# EAGLE design BusPirate-24Fv1a.final (EAGLE 5.03)
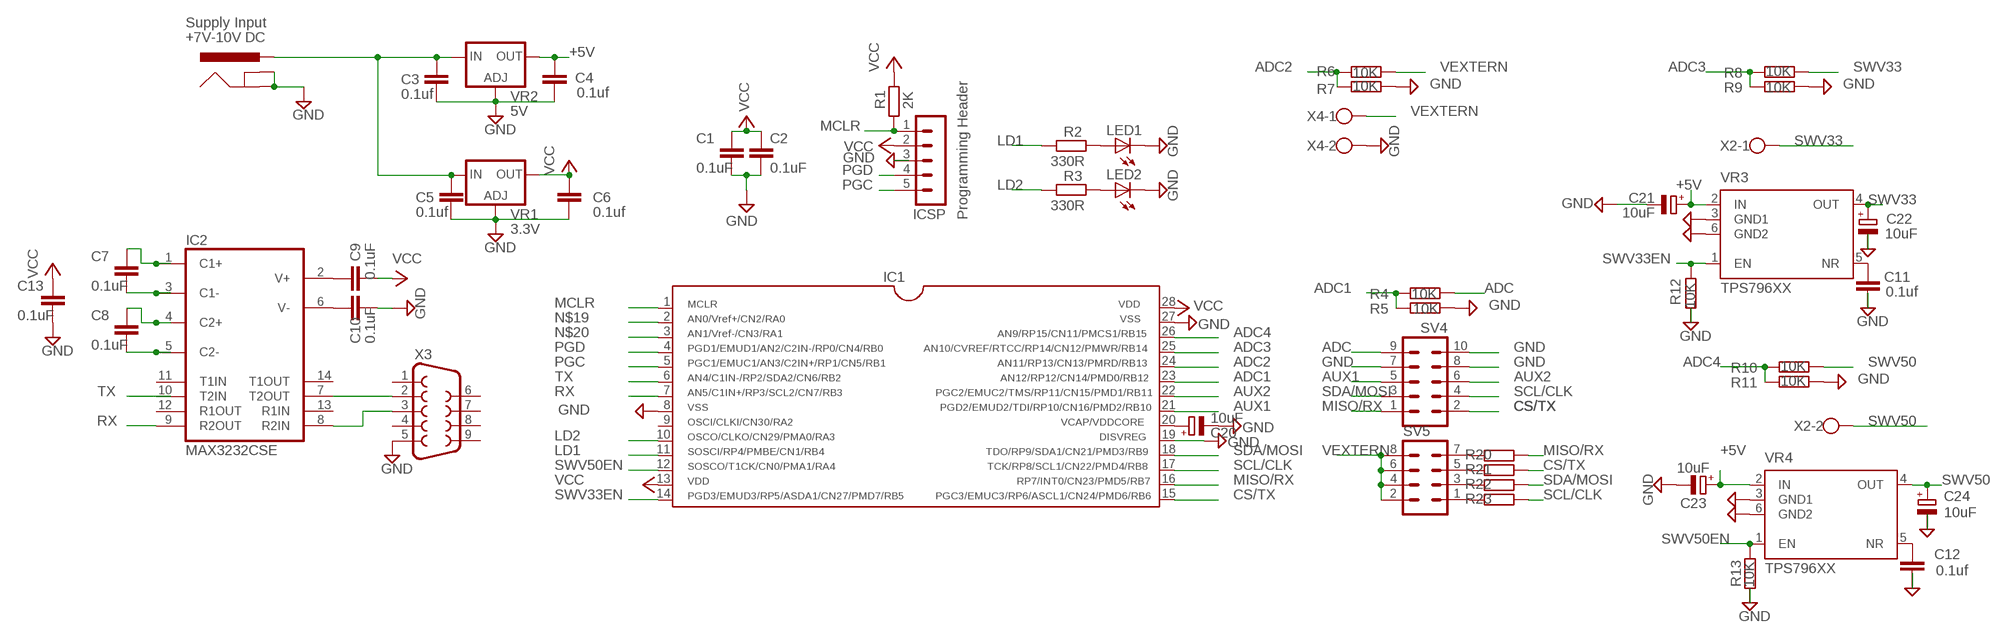
[diagram p0: schematic, sheet 1]

## Parts
C1  0.1uF  C-EUC0805  [C0805]
C2  0.1uF  C-EUC0805  [C0805]
C3  0.1uf  C-EUC0805  [C0805]
C4  0.1uf  C-EUC0805  [C0805]
C5  0.1uf  C-EUC0805  [C0805]
C6  0.1uf  C-EUC0805  [C0805]
C7  0.1uF  C-EUC0805  [C0805]
C8  0.1uF  C-EUC0805  [C0805]
C9  0.1uF  C-EUC0805  [C0805]
C10  0.1uF  C-EUC0805  [C0805]
C11  0.1uf  C-EUC0805  [C0805]
C12  0.1uf  C-EUC0805  [C0805]
C13  0.1uF  C-EUC0805  [C0805]
C20  10uF  CPOL-EUSMCA  [SMC_A]
C21  10uF  CPOL-EUSMCA  [SMC_A]
C22  10uF  CPOL-EUSMCA  [SMC_A]
C23  10uF  CPOL-EUSMCA  [SMC_A]
C24  10uF  CPOL-EUSMCA  [SMC_A]
IC1  PIC24FJ64GA002  [SO28W]
IC2  MAX3232CSE  [SO16]
ICSP  MA05-1  [MA05-1]
J1  POWER_JACKPTH  [POWER_JACK_PTH]
LED1  LEDCHIP-LED0805  [CHIP-LED0805]
LED2  LEDCHIP-LED0805  [CHIP-LED0805]
R1  2K  R-EU_R0805  [R0805]
R2  330R  R-EU_M0805  [M0805]
R3  330R  R-EU_M0805  [M0805]
R4  10K  R-EU_M0805  [M0805]
R5  10K  R-EU_M0805  [M0805]
R6  10K  R-EU_M0805  [M0805]
R7  10K  R-EU_M0805  [M0805]
R8  10K  R-EU_M0805  [M0805]
R9  10K  R-EU_M0805  [M0805]
R10  10K  R-EU_M0805  [M0805]
R11  10K  R-EU_M0805  [M0805]
R12  10K  R-EU_M0805  [M0805]
R13  10K  R-EU_M0805  [M0805]
R20  R-EU_0207/12  [0207/12]
R21  R-EU_0207/12  [0207/12]
R22  R-EU_0207/12  [0207/12]
R23  R-EU_0207/12  [0207/12]
SV4  MA05-2  [MA05-2]
SV5  MA04-2  [MA04-2]
VR1  3.3V  LD117AS12TR  [SOT223]
VR2  5V  LD117AS12TR  [SOT223]
VR3  TPS796XX  [SOT223-6]
VR4  TPS796XX  [SOT223-6]
X2  W237-102  [W237-102]
X3  F09H  [F09H]
X4  W237-102  [W237-102]

## Nets
+5V: C4.1 C21.+ C23.+ VR2.4(OUT) VR3.2(IN) VR4.2(IN)
ADC: R4.1 SV4.9
ADC1: IC1.23 R4.2 R5.2
ADC2: IC1.24 R6.2 R7.2
ADC3: IC1.25 R8.2 R9.2
ADC4: IC1.26 R10.2 R11.2
AUX1: IC1.21 SV4.5
AUX2: IC1.22 SV4.6
CS/TX: IC1.15 R21.1 SV4.2
GND: C1.2 C2.2 C3.2 C4.2 C5.2 C6.2 C10.2 C11.2 C12.2 C13.2 C20.- C21.- C22.- C23.- C24.- IC1.8 IC1.19 IC1.27 ICSP.3 J1.GND J1.GNDBREAK LED1.C LED2.C R5.1 R7.1 R9.1 R11.1 R12.2 R13.2 SV4.7 SV4.8 SV4.10 VR1.1(ADJ) VR2.1(ADJ) VR3.3(GND1) VR3.6(GND2) VR4.3(GND1) VR4.6(GND2) X3.5 X4.2
LD1: IC1.11 R2.2
LD2: IC1.10 R3.2
MCLR: IC1.1 ICSP.1 R1.1
MISO/RX: IC1.16 R20.1 SV4.1
N$1: R23.2 SV5.1
N$2: R20.2 SV5.7
N$3: C20.+ IC1.20
N$4: R21.2 SV5.5
N$5: R22.2 SV5.3
N$6: LED2.A R3.1
N$7: LED1.A R2.1
N$8: C9.2 IC2.2(V+)
N$9: C3.1 C5.1 J1.PWR VR1.3(IN) VR2.3(IN)
N$11: C10.1 IC2.6(V-)
N$13: C11.1 VR3.5(NR)
N$14: C7.2 IC2.3(C1-)
N$15: C7.1 IC2.1(C1+)
N$16: C8.1 IC2.4(C2+)
N$17: C8.2 IC2.5(C2-)
N$18: C12.1 VR4.5(NR)
N$19: IC1.2
N$20: IC1.3
N$29: IC2.7(T2OUT) X3.2
N$30: IC2.8(R2IN) X3.3
PGC: IC1.5 ICSP.5
PGD: IC1.4 ICSP.4
RX: IC1.7 IC2.9(R2OUT)
SCL/CLK: IC1.17 R23.1 SV4.4
SDA/MOSI: IC1.18 R22.1 SV4.3
SWV33: C22.+ R8.1 VR3.4(OUT) X2.1
SWV33EN: IC1.14 R12.1 VR3.1(EN)
SWV50: C24.+ R10.1 VR4.4(OUT) X2.2
SWV50EN: IC1.12 R13.1 VR4.1(EN)
TX: IC1.6 IC2.10(T2IN)
VCC: C1.1 C2.1 C6.1 C9.1 C13.1 IC1.13 IC1.28 ICSP.2 R1.2 VR1.4(OUT)
VEXTERN: R6.1 SV5.2 SV5.4 SV5.6 SV5.8 X4.1
Unconnected: IC1.9 IC2.11(T1IN) IC2.12(R1OUT) IC2.13(R1IN) IC2.14(T1OUT) X3.1 X3.4 X3.6 X3.7 X3.8 X3.9

## Notes on the sheet
- Supply Input
- +7V-10V DC
- Programming Header

## Power pins joined to a net without a drawn wire
GND: IC2.15(GND)
VCC: IC2.16(VCC)

## Library data of the parts
C1-C13 = rcl:C-EU: CAPACITOR, European symbol
C20-C24 = rcl:CPOL-EU: POLARIZED CAPACITOR, European symbol
IC1 = microchip-pic24:PIC24FJ64GA002
IC2 = maxim:MAX3232*: True RS-232 Transceivers 3.0V to 5.5V, Low-Power up to 1Mbps, Using Four 0.1µF External Capacitors Source: http://pdfserv.maxim-ic.com/en/ds/MAX3222-MAX3241.pdf
ICSP = con-lstb:MA05-1: PIN HEADER
J1 = SparkFun:POWER_JACK: Power Jack This is the standard 5.5mm barrel jack for power. The PTH is the most common, proven, reliable, footprint. All others are experimental. The Slot footprint only works if the mill layer is transmitted to the PCB fab house so be warned. Spark Fun Electronics SKU : PRT-00119. Mating wall wart : TOL-00298 (and others)
LED1 LED2 = led:LED: LED OSRAM: - CHIPLED LG R971, LG N971, LY N971, LG Q971, LY Q971, LO R971, LY R971 LH N974, LH R974 LS Q976, LO Q976, LY Q976 LO Q996 - Hyper CHIPLED LW Q18S LB Q993, LB Q99A, LB R99A - SideLED LS A670, LO A670, LY A670, LG A670, LP A670 LB A673, LV A673, LT A673, LW A673 LH A674 LY A675 LS A676, LA A676, LO A676, LY A676, LW A676 LS A679, LY A679, LG A679 - Hyper Micro SIDELED® LS Y876, LA Y876, LO Y876, LY Y876 LT Y87S - SmartLED LW L88C, LW L88S LB L89C, LB L89S, LG L890 LS L89K, LO L89K, LY L89K LS L896, LA L896, LO L896, LY L896 - TOPLED LS T670, LO T670, LY T670, LG T670, LP T670 LSG T670, LSP T670, LSY T670, LOP T670, LYG T670 LG T671, LOG T671, LSG T671 LB T673, LV T673, LT T673, LW T673 LH T674 LS T676, LA T676, LO T676, LY T676, LB T676, LH T676, LSB T676, LW T676 LB T67C, LV T67C, LT T67C, LS T67K, LO T67K, LY T67K, LW E67C LS E67B, LA E67B, LO E67B, LY E67B, LB E67C, LV E67C, LT E67C LW T67C LS T679, LY T679, LG T679 LS T770, LO T770, LY T770, LG T770, LP T770 LB T773, LV T773, LT T773, LW T773 LH T774 LS E675, LA E675, LY E675, LS T675 LS T776, LA T776, LO T776, LY T776, LB T776 LHGB T686 LT T68C, LB T68C - Hyper Mini TOPLED® LB M676 - Mini TOPLED Santana® LG M470 LS M47K, LO M47K, LY M47K Source: http://www.osram.convergy.de LUXEON: - LUMILED® LXK2-PW12-R00, LXK2-PW12-S00, LXK2-PW14-U00, LXK2-PW14-V00 LXK2-PM12-R00, LXK2-PM12-S00, LXK2-PM14-U00 LXK2-PE12-Q00, LXK2-PE12-R00, LXK2-PE12-S00, LXK2-PE14-T00, LXK2-PE14-U00 LXK2-PB12-K00, LXK2-PB12-L00, LXK2-PB12-M00, LXK2-PB14-N00, LXK2-PB14-P00, LXK2-PB14-Q00 LXK2-PR12-L00, LXK2-PR12-M00, LXK2-PR14-Q00, LXK2-PR14-R00 LXK2-PD12-Q00, LXK2-PD12-R00, LXK2-PD12-S00 LXK2-PH12-R00, LXK2-PH12-S00 LXK2-PL12-P00, LXK2-PL12-Q00, LXK2-PL12-R00 Source: www.luxeon.com KINGBRIGHT: KA-3528ASYC Source: www.kingbright.com
R1-R3 R20-R23 = rcl:R-EU_: RESISTOR, European symbol
R4-R13 = resistor:R-EU_: RESISTOR, European symbol
SV4 = con-lstb:MA05-2: PIN HEADER
SV5 = con-lstb:MA04-2: PIN HEADER
VR1 VR2 = v-reg:LD117A?*: Low drop fixed and adjustable positive voltage regulators 1 A Source: http://www.st.com/stonline/products/literature/ds/7194/ld1117axx.pdf
VR3 VR4 = SOT223-6:TPS796XX
X2 X4 = con-wago-500:W237-102: WAGO SCREW CLAMP
X3 = con-subd:F09: SUB-D

## Board
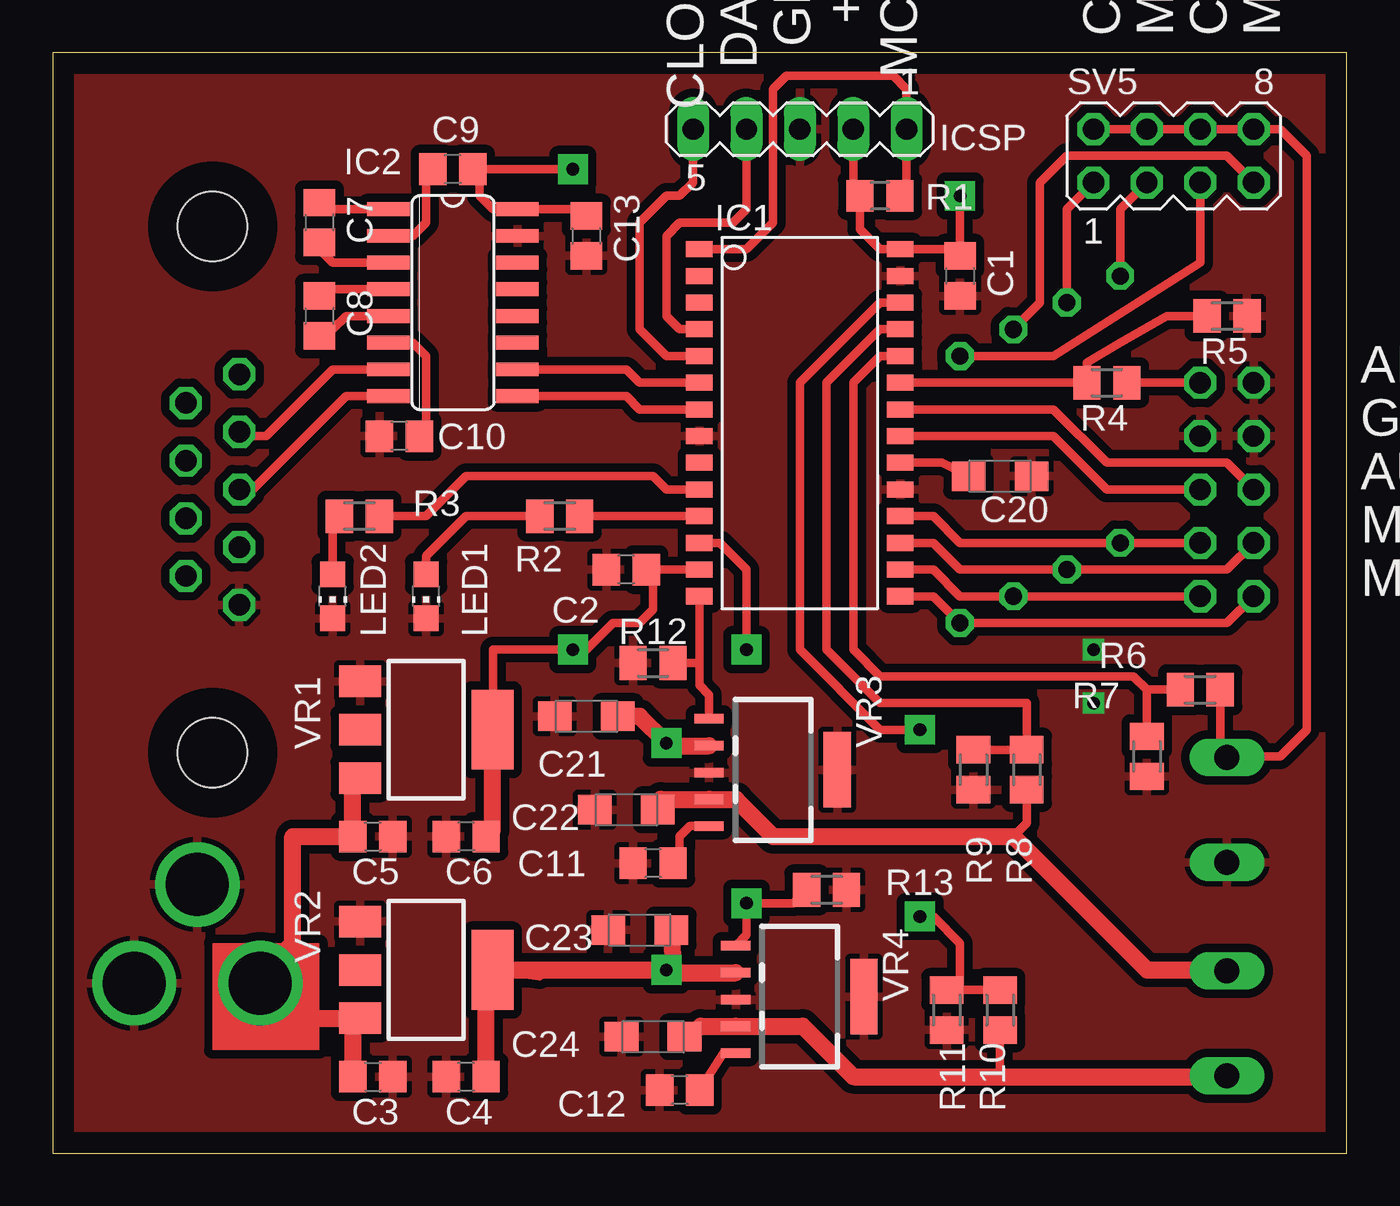
[diagram p1: board, top side]
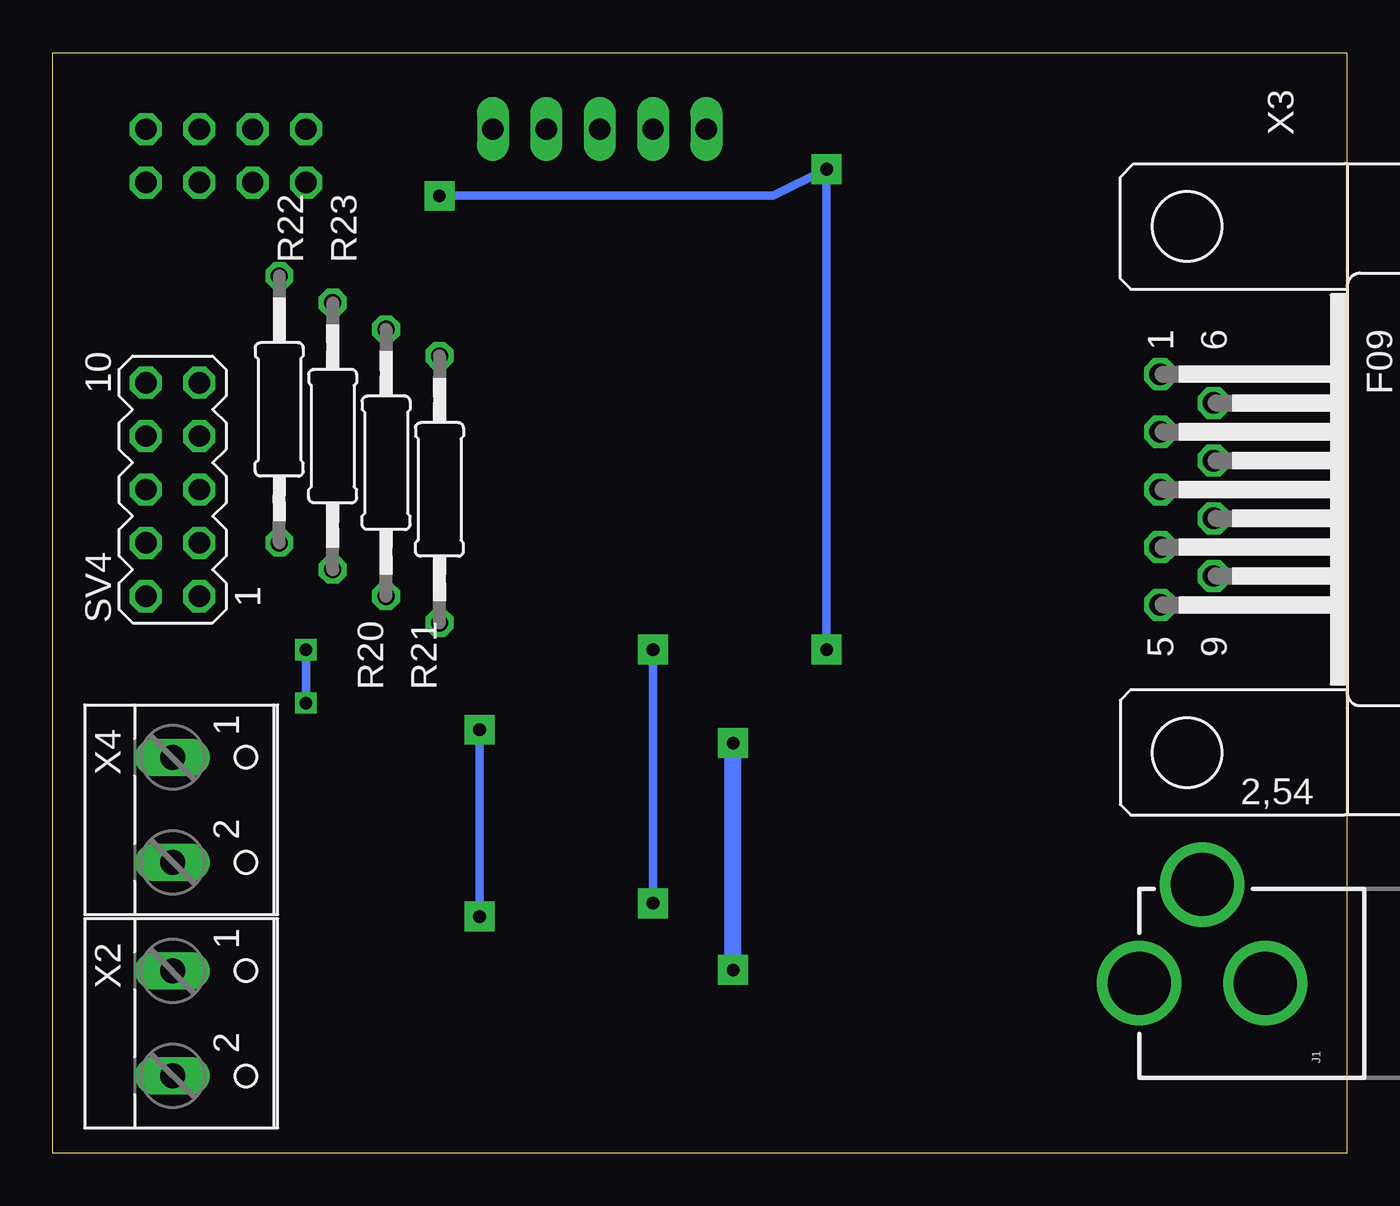
[diagram p2: board, bottom side, seen from below]

Size 61.59 x 52.38 mm. Coordinates in mm from the lower left corner, seen from the top.
Outline: 61.59,0 61.59,52.38 0,52.38 0,0 61.59,0
Copper layers (1*16): Top 0.035mm / dielectric 1.5mm / Bottom 0.035mm
Design rules "10mils": minimum track width 10mil, minimum drill 24mil, track to track 10mil, track to pad 10mil, pad to pad 10mil, via to via 10mil, smd to smd 10mil, copper to edge 40mil, drill to drill 10mil, minimum pad ring 10mil, minimum via ring 8mil, stop-mask expansion 0mil, vias tented up to drill 0mil, thermal gap 10mil

### Footprints (pad centres in the part's own frame; a part is rotated, then mirrored left to right if it is on the bottom)
C0805 = smd 1.3 x 1.5: 1 -0.95,0; 2 0.95,0
SMC_A = smd 1.6 x 1.4: + -1.5,0; - 1.5,0
SO28W = smd 0.762 x 1.27: 1 -8.89,-4.78; 2 -7.62,-4.78; 3 -6.35,-4.78; 4 -5.08,-4.78; 5 -3.81,-4.78; 6 -2.54,-4.78; 7 -1.27,-4.78; 8 0,-4.78; 9 1.27,-4.78; 10 2.54,-4.78; 11 3.81,-4.78; 12 5.08,-4.78; 13 6.35,-4.78; 14 7.62,-4.78; 15 7.62,4.78; 16 6.35,4.78; 17 5.08,4.78; 18 3.81,4.78; 19 2.54,4.78; 20 1.27,4.78; 21 0,4.78; 22 -1.27,4.78; 23 -2.54,4.78; 24 -3.81,4.78; 25 -5.08,4.78; 26 -6.35,4.78; 27 -7.62,4.78; 28 -8.89,4.78
SO16 = smd 0.66 x 2.032: 1 -4.445,-3.073; 2 -3.175,-3.073; 3 -1.905,-3.073; 4 -0.635,-3.073; 5 0.635,-3.073; 6 1.905,-3.073; 7 3.175,-3.073; 8 4.445,-3.073; 9 4.445,3.073; 10 3.175,3.073; 11 1.905,3.073; 12 0.635,3.073; 13 -0.635,3.073; 14 -1.905,3.073; 15 -3.175,3.073; 16 -4.445,3.073
MA05-1 = drill 1.016 long: 1 -5.08,0; 2 -2.54,0; 3 0,0; 4 2.54,0; 5 5.08,0
POWER_JACK_PTH = drill 2.997 round: GND 0,7.7; GNDBREAK 4.7,10.7; PWR 0,13.7
CHIP-LED0805 = smd 1.2 x 1.2: A 0,-1.05; C 0,1.05
R0805 = smd 1.3 x 1.5: 1 -0.95,0; 2 0.95,0
M0805 = smd 1.3 x 1.6: 1 -0.95,0; 2 0.95,0
0207/12 = drill 0.813 octagon: 1 -6.35,0; 2 6.35,0
MA05-2 = drill 1.016 octagon: 1 -5.08,-1.27; 2 -5.08,1.27; 3 -2.54,-1.27; 4 -2.54,1.27; 5 0,-1.27; 6 0,1.27; 7 2.54,-1.27; 8 2.54,1.27; 9 5.08,-1.27; 10 5.08,1.27
MA04-2 = drill 1.016 octagon: 1 -3.81,-1.27; 2 -3.81,1.27; 3 -1.27,-1.27; 4 -1.27,1.27; 5 1.27,-1.27; 6 1.27,1.27; 7 3.81,-1.27; 8 3.81,1.27
SOT223 = smd 1.5 x 2: 1 -2.3,-3.15; 2 0,-3.15; 3 2.3,-3.15 | smd 3.8 x 2: 4 0,3.15
SOT223-6 = smd 0.457 x 1.397: 1 -2.427,-4.32; 2 -1.143,-4.32; 3 0.141,-4.32; 4 1.411,-4.32; 5 2.681,-4.32 | smd 3.6 x 1.3: 6 0,1.78
W237-102 = drill 1.194 long: 1 -2.5,-1.27; 2 2.5,-1.27
F09H = drill 1.016 octagon: 1 -5.486,-1.27; 2 -2.743,-1.27; 3 0,-1.27; 4 2.743,-1.27; 5 5.486,-1.27; 6 -4.115,1.27; 7 -1.372,1.27; 8 1.372,1.27; 9 4.115,1.27 | hole 3.302: -12.522,0; 12.522,0

### Placement (x,y rotation side)
C1  43.18,41.75 270 top
C2  27.3,27.77 180 top
C3  15.24,3.65 0 top
C4  19.68,3.65 180 top
C5  15.24,15.08 0 top
C6  19.68,15.08 180 top
C7  12.7,44.29 270 top
C8  12.7,39.84 270 top
C9  19.05,46.83 180 top
C10  16.51,34.12 180 top
C11  28.57,13.81 180 top
C12  29.84,3.01 180 top
C13  25.4,43.65 270 top
C20  45.08,32.22 0 top
C21  25.4,20.79 180 top
C22  27.3,16.34 180 top
C23  27.94,10.63 180 top
C24  28.57,5.55 180 top
IC1  35.55,34.12 270 top
IC2  19.05,40.48 270 top
ICSP  35.55,48.73 180 top
J1  -3.81,8.09 90 bottom
LED1  17.78,26.51 180 top
LED2  13.33,26.51 180 top
R1  39.37,45.55 180 top
R2  24.12,30.32 0 top
R3  14.6,30.32 0 top
R4  50.16,36.66 180 top
R5  55.88,39.84 180 top
R6  54.61,22.06 180 top
R7  52.07,18.89 90 top
R8  46.35,18.25 90 top
R9  43.81,18.25 90 top
R10  45.08,6.82 90 top
R11  42.54,6.82 90 top
R12  28.57,23.33 180 top
R13  36.83,12.54 0 top
R20  45.72,32.86 90 bottom
R21  43.18,31.59 90 bottom
R22  50.8,35.4 90 bottom
R23  48.26,34.12 90 bottom
SV4  55.88,31.59 90 bottom
SV5  53.34,47.46 0 top
VR1  17.78,20.16 270 top
VR2  17.78,8.72 270 top
VR3  35.55,18.25 270 top
VR4  36.83,7.46 270 top
X2  54.61,6.19 270 bottom
X3  7.62,31.59 270 bottom
X4  54.61,16.34 270 bottom

### Tracks (layer width: path | path; a pad name or v marks a point on that pad's centre or on a via)
+5V  (via drill 0.6 pad 1.42)
  Top 0.406: VR2.4 23.17,8.43 | 29.56,8.85 29.33,8.85 v29.21,8.72 | 29.33,19.39 29.33,19.42
  Top 0.813: 29.56,8.85 C23.+ | 21.59,8.72 VR2.4 | 21.59,8.72 v29.21,8.72 29.33,8.6 VR4.2 | C4.1 20.63,7.77 21.59,8.72 | VR3.2 29.33,19.39 v29.21,19.52 27.94,20.79 C21.+
  Bottom 0.813: v29.21,8.72 v29.21,19.52
ADC
  Top 0.406: R4.1 SV4.9
ADC1
  Top 0.406: R5.2 53.02,39.84 50.8,38.57 49.21,37.62 R4.2 IC1.23
ADC2
  Top 0.406: IC1.24 39.37,37.94 38.09,36.66 38.09,23.97 39.37,22.7 51.43,22.7 52.07,22.06 | 52.07,22.06 R6.2 | 52.07,22.06 R7.2
ADC3
  Top 0.406: R9.2 R8.2 46.35,21.43 39.37,21.43 36.83,23.97 36.83,36.66 39.37,39.21 IC1.25
ADC4  (via drill 0.6 pad 1.42)
  Top 0.406: R11.2 43.18,7.77 | 43.18,7.77 R10.2 | IC1.26 39.37,40.48 35.55,36.66 35.55,23.97 39.37,20.16 v41.27,20.16 | v41.27,11.26 41.91,11.26 43.18,9.99 43.18,7.77
  Bottom 0.406: v41.27,11.26 v41.27,20.16
AUX1
  Top 0.406: IC1.21 47.62,34.12 50.16,31.59 SV4.5
AUX2
  Top 0.406: IC1.22 47.62,35.4 50.16,32.86 55.88,32.86 SV4.6
CS/TX
  Top 0.406: IC1.15 41.91,26.51 R21.1 55.88,25.23 SV4.2
GND  (via drill 0.6 pad 1.02)
  Bottom 0.406: v49.52,21.43 v49.52,23.97
  pour Top (isolate 0.406): 0,51.91 60.95,51.91 60.95,1.11 0,1.11
LD1
  Top 0.406: R2.2 IC1.11
LD2
  Top 0.406: IC1.10 29.21,31.59 28.57,32.22 19.68,32.22 17.78,30.32 R3.2
MCLR
  Top 0.406: R1.1 40.63,45.88 ICSP.1 40.63,50.63 40,51.27 34.92,51.27 34.29,50.63 34.29,44.29 33.02,43.02 IC1.1
MISO/RX
  Top 0.406: SV4.1 R20.1 43.18,26.51 41.91,27.77 IC1.16
N$1
  Top 0.406: R23.2 48.26,44.92 SV5.1
N$2
  Top 0.406: R20.2 46.98,40.48 46.98,46.19 48.26,47.46 55.88,47.46 SV5.7
N$3
  Top 0.406: IC1.20 42.31,32.86 C20.+
N$4
  Top 0.406: R21.2 47.62,37.94 54.61,42.38 SV5.5
N$5
  Top 0.406: R22.2 50.8,44.92 SV5.3
N$6
  Top 0.406: LED2.A 13.33,30 R3.1
N$7
  Top 0.406: R2.1 19.68,30.32 17.78,28.41 LED1.A
N$8
  Top 0.406: IC2.2 17.14,43.65 17.78,44.29 17.78,46.51 C9.2
N$9
  Top 0.406: 14.29,17.52 VR1.3 | J1.PWR 10.15,8.36 | VR2.3 13.96,6.42 14.29,6.1
  Top 0.813: 14.29,17.52 C5.1 11.42,15.08 11.42,9.99 10.15,8.72 10.15,8.36 | 13.96,6.42 11.55,6.42 J1.PWR | 14.29,6.1 C3.1
N$11
  Top 0.406: IC2.6 17.14,38.57 17.78,37.94 17.78,34.45 C10.1
N$13
  Top 0.406: VR3.5 30.33,15.57 29.84,15.08 29.84,14.13 C11.1
N$14
  Top 0.406: IC2.3 13.33,42.38 12.7,43.02 12.38,43.02 C7.2
N$15
  Top 0.406: IC2.1 12.38,44.92 C7.1
N$16
  Top 0.406: IC2.4 12.38,41.11 C8.1
N$17
  Top 0.406: IC2.5 13.96,39.84 13.33,39.21 12.7,39.21 | 12.7,39.21 12.38,39.21 | C8.2 12.7,39.21
N$18
  Top 0.406: VR4.5 31.92,4.77 C12.1
N$29
  Top 0.406: IC2.7 13.33,37.3 10.15,34.12 9.09,34.12 X3.2
N$30
  Top 0.406: X3.3 9.52,31.59 13.96,36.03 IC2.8
PGC
  Top 0.406: IC1.5 29.21,37.94 27.94,39.21 27.94,44.29 29.21,45.55 29.84,45.55 30.48,46.19 ICSP.5
PGD
  Top 0.406: IC1.4 29.84,39.21 29.21,39.84 29.21,43.65 29.84,44.29 32.38,44.29 33.02,44.92 ICSP.4
RX
  Top 0.406: IC2.9 27.3,36.03 27.94,35.4 IC1.7
SCL/CLK
  Top 0.406: IC1.17 41.91,29.05 43.18,27.77 R23.1 55.88,27.77 SV4.4
SDA/MOSI
  Top 0.406: IC1.18 41.91,30.32 43.18,29.05 R22.1 SV4.3
SWV33
  Top 0.406: R8.1 46.35,15.71 45.72,15.08
  Top 0.813: X2.1 55.84,8.72 52.07,8.72 45.72,15.08 34.29,15.08 32.52,16.84 VR3.4 28.94,16.84 C22.+
SWV33EN
  Top 0.406: 30.77,23.33 30.77,22.28 31.23,21.82 VR3.1 | 30.77,23.33 IC1.14 | 30.77,23.33 R12.1
SWV50
  Top 0.406: 55.84,3.65 X2.2 | 45.08,3.65 R10.1
  Top 0.813: 55.84,3.65 45.08,3.65 38.09,3.65 35.7,6.04 VR4.4 30.85,6.04 C24.+
SWV50EN  (via drill 0.6 pad 1.42)
  Top 0.406: IC1.12 31.75,29.05 33.02,27.77 v33.02,23.97 | VR4.1 33.02,10.39 v33.02,11.9 35.24,11.9 R13.1
  Bottom 0.406: v33.02,11.9 v33.02,23.97
TX
  Top 0.406: IC2.10 27.3,37.3 27.94,36.66 IC1.6
VCC  (via drill 0.6 pad 1.42)
  Top 0.406: C6.1 20.93,15.37 | VR1.4 20.95,20.82 20.95,23.97 v24.76,23.97 25.4,23.97 26.67,25.23 27.94,25.23 28.57,25.87 28.57,27.46 C2.1 IC1.13 | v24.76,46.83 C9.1 20.32,46.51 20.32,45.55 20.95,44.92 IC2.16 25.08,44.92 C13.1 | ICSP.2 38.09,45.88 R1.2 38.41,43.97 39.37,43.02 IC1.28 42.86,43.02 C1.1 v43.18,45.55
  Top 0.813: 20.93,15.37 VR1.4
  Bottom 0.406: v24.76,23.97 v24.76,46.83 27.3,45.55 v43.18,45.55
VEXTERN
  Top 0.406: SV5.2 SV5.4 SV5.6 SV5.8 58.41,48.73 59.69,47.46 59.69,20.16 58.41,18.89 55.91,18.89 X4.1 55.55,19.16 R6.1
(copper drawn outside any net)
  shapes: Top area x1

### Text on the board
tPlace: Pull-up jumpers | I/O header
tNames: Programming Header | CLOCK | DATA | GND | +5V | MCLR | CLK | MOSI | CS | MISO | ADC | GND | GND | GND | AUX1 | AUX2 | MOSI | CLK | MISO | CS | Serial port | Vpullup | GND | 3.3volts | 5volts | +7-12volts DC